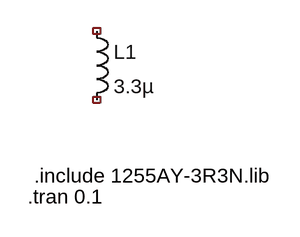
[diagram p0: schematic InductorSimulation.asc]
InductorSimulation.asc, the LTspice schematic file:
Version 4.1
SHEET 1 880 680
SYMBOL ind 128 48 R0
SYMATTR InstName L1
SYMATTR Value 3.3µ
SYMATTR SpiceLine Ipk=5.2 Rser=0.021 Rpar=0 Cpar=0 mfg="Murata" pn="1255AY-3R3N=P3"
TEXT 72 232 Left 2 !.include 1255AY-3R3N.lib
TEXT 64 256 Left 2 !.tran 0.1

The netlist it stands for:
* InductorSimulation.asc
L1 NC_01 NC_02 3.3µ Ipk=5.2 Rser=0.021 Rpar=0 Cpar=0 mfg="Murata" pn="1255AY-3R3N=P3"
.include 1255AY-3R3N.lib
.tran 0.1
.backanno
.end